# EAGLE schematic ONOFRE_ESTORES_COVERS_R3.0 (EAGLE 9.6.2)
CNAME: BH ONOFRE; CREVISION: 5.1; DESIGNER: BrunoHorta
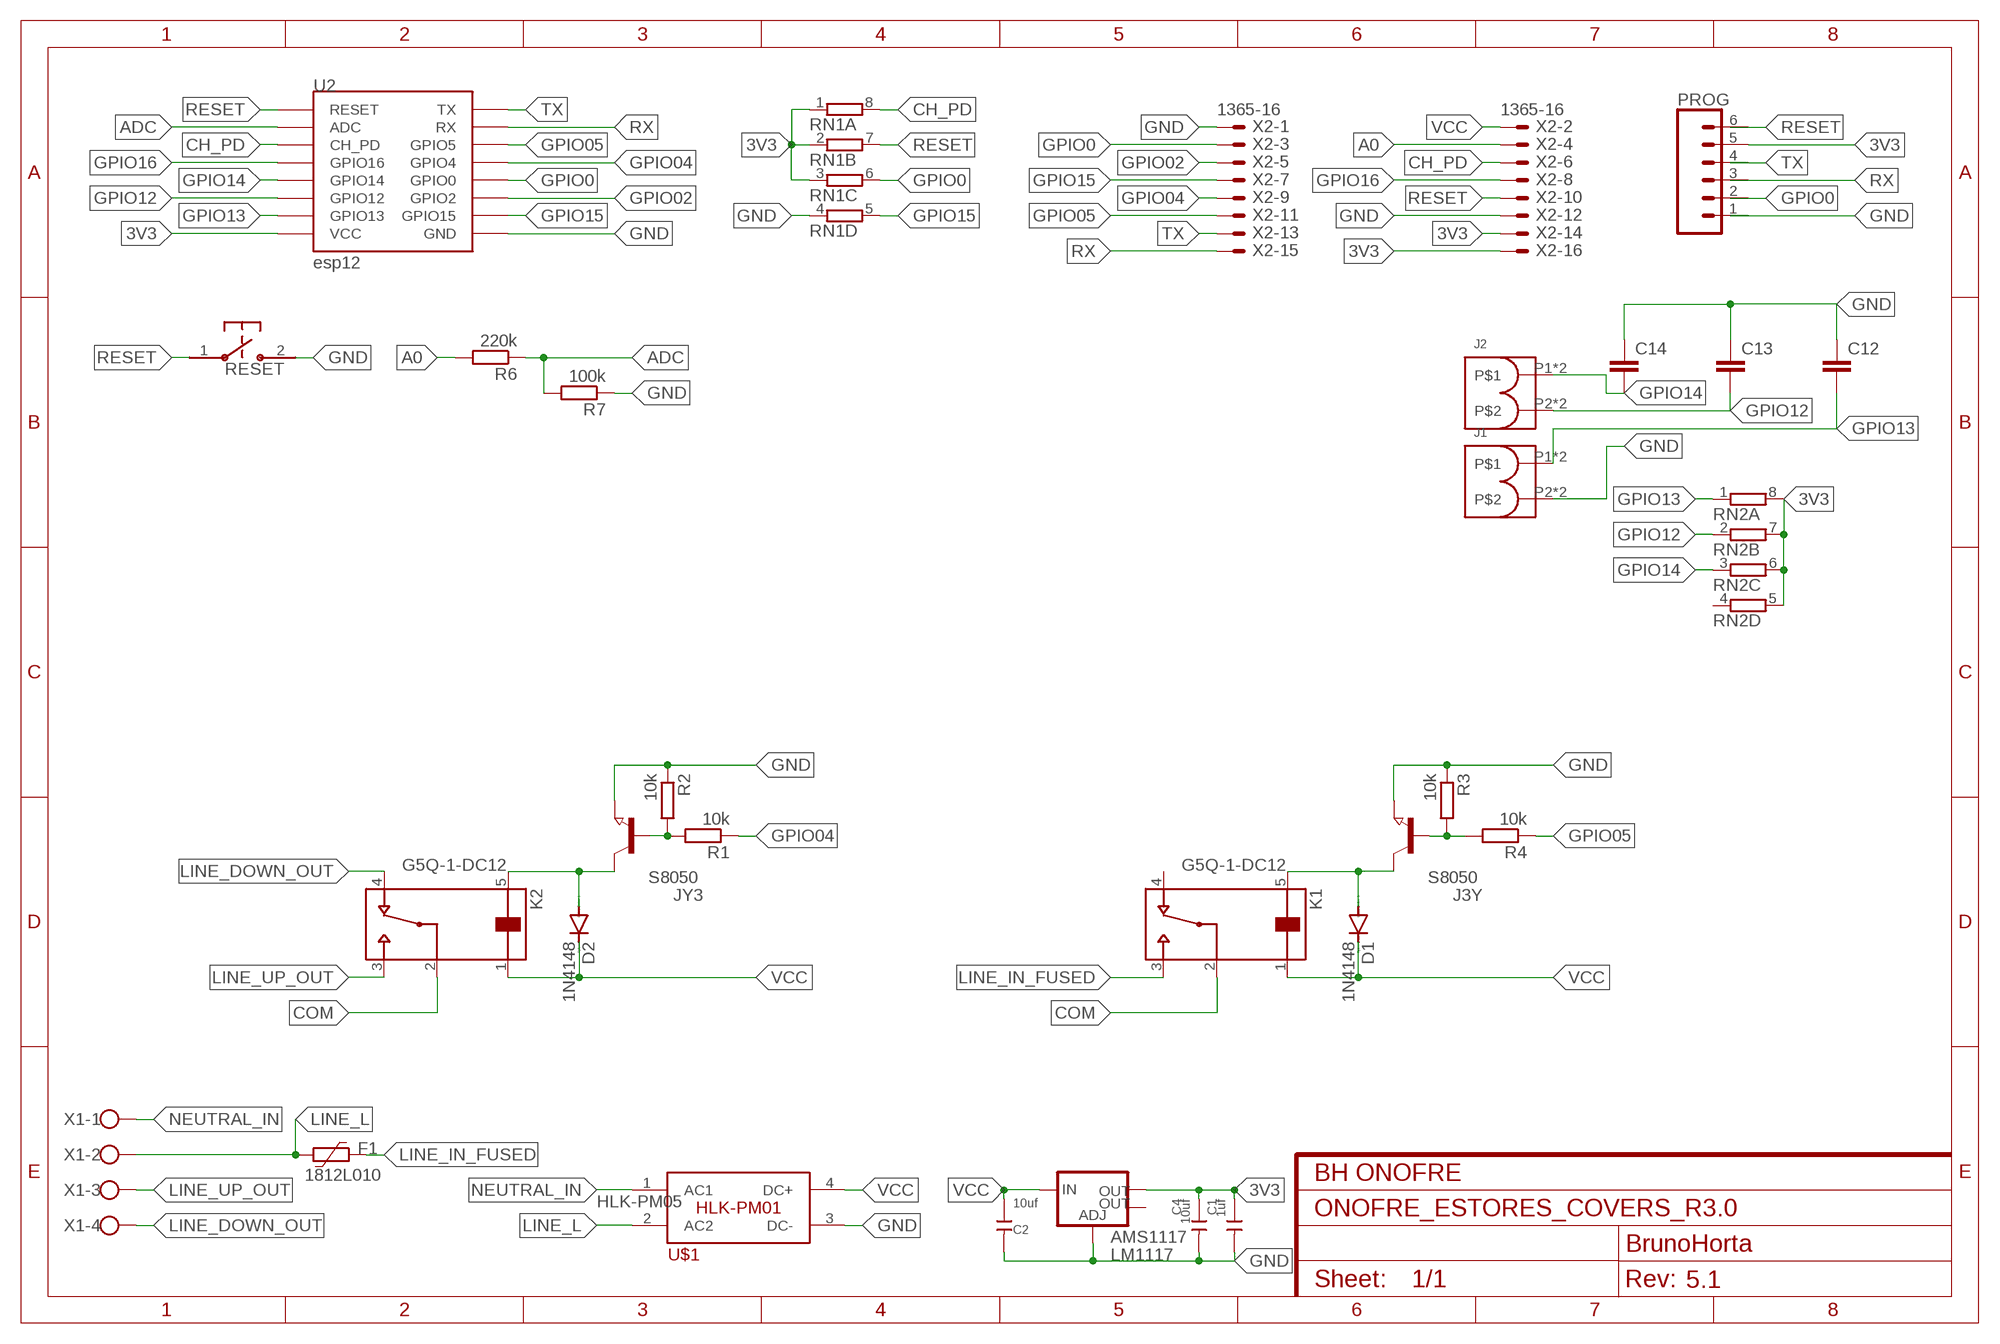
[diagram p0: schematic, sheet 1]

## Parts
AMS1117  LM1117  V_REG_LM1117SOT223  [SOT223]
C1  1uf  CERAMIC-1NF-1KV-10%-X7R(1206)  [C1206]
C2  10uf  CERAMIC-1NF-1KV-10%-X7R(1206)  [C1206]
C4  10uf  CERAMIC-1NF-1KV-10%-X7R(1206)  [C1206]
C12  C-EUC0805  [C0805]
C13  C-EUC0805  [C0805]
C14  C-EUC0805  [C0805]
D1  1N4148  DIODE-SOD80C  [SOD80C]
D2  1N4148  DIODE-SOD80C  [SOD80C]
F1  1812L010  [1812L]
J1  46.142.1001  [P_46.142.1001]
J2  46.142.1001  [P_46.142.1001]
J3Y  S8050  NPN-TRANSISTOR_SOT23  [SOT23]
JY3  S8050  NPN-TRANSISTOR_SOT23  [SOT23]
K1  G5Q-1-DC12  [RELAY_G5Q-1-DC12]
K2  G5Q-1-DC12  [RELAY_G5Q-1-DC12]
PROG  CONN_06NO_SILK_NO_POP  [1X06_NO_SILK]
R1  10k  R-EU_R0603  [R0603]
R2  10k  R-EU_R0603  [R0603]
R3  10k  R-EU_R0603  [R0603]
R4  10k  R-EU_R0603  [R0603]
R6  220k  R-EU_R0603  [R0603]
R7  100k  R-EU_R0603  [R0603]
RESET  B3U-1000P-2P-SMD  B3U-1000P  [B3U-1000P]
RN1  4R-N0603-ARV  [0603-ARV]
RN2  4R-N0603-ARV  [0603-ARV]
U2  esp12  ESP12SMD  [ESP12-SMD]
U$1  HLK-PM01  [HLK-PM01]
X1  W237-4  [W237-4]
X2  1365-16  [1365-16]

## Nets
3V3: AMS1117.2(OUT) C1.1 C4.1 PROG.5 RN1.1 RN1.2 RN1.3 RN2.5 RN2.6 RN2.7 RN2.8 U2.VCC X2.14 X2.16
A0: R6.2 X2.4
ADC: R6.1 R7.2 U2.ADC
CH_PD: RN1.8 U2.CH_PD X2.6
COM: K1.2 K2.2
GND: AMS1117.1(ADJ) C1.2 C2.2 C4.2 C12.1 C13.1 C14.1 J1.P2 J1.P2.1 J3Y.2(E) JY3.2(E) PROG.1 R2.1 R3.1 R7.1 RESET.2 RN1.4 U2.GND U$1.3(DC-) X2.1 X2.12
GPIO0: PROG.2 RN1.6 U2.GPIO0 X2.3
GPIO02: U2.GPIO2 X2.5
GPIO04: R1.1 U2.GPIO4 X2.9
GPIO05: R4.1 U2.GPIO5 X2.11
GPIO12: C13.2 J2.P2 J2.P2.1 RN2.2 U2.GPIO12
GPIO13: C12.2 J1.P1 J1.P1.1 RN2.1 U2.GPIO13
GPIO14: C14.2 J2.P1 J2.P1.1 RN2.3 U2.GPIO14
GPIO15: RN1.5 U2.GPIO15 X2.7
GPIO16: U2.GPIO16 X2.8
LINE_DOWN_OUT [220V]: K2.4 X1.4
LINE_IN_FUSED [220V]: F1.1 K1.3
LINE_L [220V]: F1.2 U$1.2(AC2) X1.2
LINE_UP_OUT [220V]: K2.3 X1.3
N$1: D1.A J3Y.3(C) K1.5
N$7: J3Y.1(B) R3.2 R4.2
N$9: D2.A JY3.3(C) K2.5
N$13: JY3.1(B) R1.2 R2.2
NEUTRAL_IN [220V]: U$1.1(AC1) X1.1
RESET: PROG.6 RESET.1 RN1.7 U2.RESET X2.10
RX: PROG.3 U2.RXD0(RX) X2.15
TX: PROG.4 U2.TXD0(TX) X2.13
VCC: AMS1117.3(IN) C2.1 D1.C D2.C K1.1 K2.1 U$1.4(DC+) X2.2
Unconnected: AMS1117.4(OUT) K1.4 RN2.4

## Notes on the sheet
- HLK-PM05

## Library data of the parts
AMS1117 = SparkFun-IC-Power:V_REG_LM1117: Voltage Regulator LM1117 Standard adjustable voltage regulator but in SMD form. Spark Fun Electronics SKU : COM-00595; PROD_ID: VREG-08170
C1 C2 C4 = Seeed-Capacitor:CERAMIC-1NF-1KV-10%-X7R?(1206): 302010189; MPN: CC1206KKX7RCBB102; VALUE: 1NF
C12-C14 = rcl:C-EU: CAPACITOR, European symbol; SPICEPREFIX: C
D1 D2 = diode:DIODE-: DIODE
F1 = polyfuse-smd_10:?: Polyfuse Resettable PTC Source: http://www.littelfuse.com/products/resettable-ptcs.aspx; MF: Littelfuse; MPN: 1812L010; OC_FARNELL: 1822210; OC_NEWARK: 78R5551
J1 J2 = BJB_Library:46.142.1001: 46.142.1001, SMD-Leiterplattenklemme Nano 2-polig 46.142.1001, SMD terminal block Nano 2-pole Die aktuellen Daten zu diesem Artikel finden Sie in unserem Produktkatalog unter www.bjb.com <https://www.bjb.com/Produkte/Licht-Komponenten/LED-Licht-und-Verbindungstechnik/Komponente-fuer-LED-Platinen/SMD-Leiterplattenklemme/46.142.1001?c=15265>. Please find the latest data for this article in our product catalogue on www.bjb.com <https://www.bjb.com/en/Products/Lighting-Components/LED/Components-for-LED-Boards/SMD-Terminal-block/5592/46.142.1001?c=15265>.
J3Y JY3 = semicon-smd-ipc:NPN-TRANSISTOR_: NPN TRANSISTOR
K1 K2 = G5Q-1-DC12:G5Q-1-DC12: Power Relay 12VDC 5(NO)A/3(NC)DCA/10(NO)A/3(NC)ACA SPDT (( 20.3mm 10.3mm 16.2mm)) Through Hole; AVAILABILITY: Unavailable; DESCRIPTION: Power Relay 12VDC 5_NO_A/3_NC_DCA/10_NO_A/3_NC_ACA SPDT __ 20.3mm 10.3mm 16.2mm__ Through Hole; MF: Omron; MP: G5Q-1-DC12; PACKAGE: None; PRICE: None
PROG = BH-PROG:CONN_06: Multi connection point. Often used as Generic Header-pin footprint for 0.1 inch spaced/style header connections On any of the 0.1 inch spaced packages, you can populate with these: Break Away Headers - Straight <https://www.sparkfun.com/products/116> (PRT-00116) Break Away Male Headers - Right Angle <https://www.sparkfun.com/products/553> (PRT-00553) Female Headers <https://www.sparkfun.com/products/115> (PRT-00115) Break Away Headers - Machine Pin <https://www.sparkfun.com/products/117> (PRT-00117) Break Away Female Headers - Swiss Machine Pin <https://www.sparkfun.com/products/743> (PRT-00743) Arduino Stackable Header - 6 Pin <https://www.sparkfun.com/products/9280> (PRT-09280) For SCREWTERMINALS and SPRING TERMINALS visit here: Screw Terimnals on SparkFun.com <https://www.sparkfun.com/search/results?term=Screw+Terminals> (5mm/3.5mm/2.54mm spacing) This device is also useful as a general connection point to wire up your design to another part of your project. Our various solder wires solder well into these plated through hole pads. Hook-Up Wire - Assortment (Stranded, 22 AWG) <https://www.sparkfun.com/products/11375> (PRT-11375) Hook-Up Wire - Assortment (Solid Core, 22 AWG) <https://www.sparkfun.com/products/11367> (PRT-11367) View the entire wire category on our website here <https://www.sparkfun.com/categories/141>
R1-R4 R6 R7 = resistor:R-EU_: RESISTOR, European symbol
RESET = switches:B3U: Switch; DIGIKEY: SW1020CT-ND; MANUFACTURER: Omron; MPN: B3U-1000P
RN1 RN2 = resistor-dil:4R-N: Array Chip Resistor Source: RS Component / Phycomp; OC_FARNELL: unknown; OC_NEWARK: unknown
U2 = esp8266modules:ESP12: ESP8266 Wifi module 12
U$1 = HLK-PM01:HLK-PM01; AVAILABILITY: Unavailable; MF: Hi-link; MP: hlk-pm01; PACKAGE: Package Analog Devices; PRICE: None
X1 = con-wago-500:W237-4: WAGO SCREW CLAMP; OC_FARNELL: unknown; OC_NEWARK: unknown
X2 = con-leotronics-bh:1365-16: DUAL ROW STRAIGHT HEADER 1364 SERIES. 1.27mm x 1.27mm. Without Fixing Post. SMT Source: http://www.leotronics.co.uk/Conexcon/Data%20Sheets/sec.%20A/1364ing.pdf; OC_FARNELL: unknown; OC_NEWARK: unknown; SPICEPREFIX: X

## Net classes
1 220V: width 1.27 mm, clearance 1.7 mm